# EAGLE design tvbgonesmd4led (EAGLE 6.5.0)
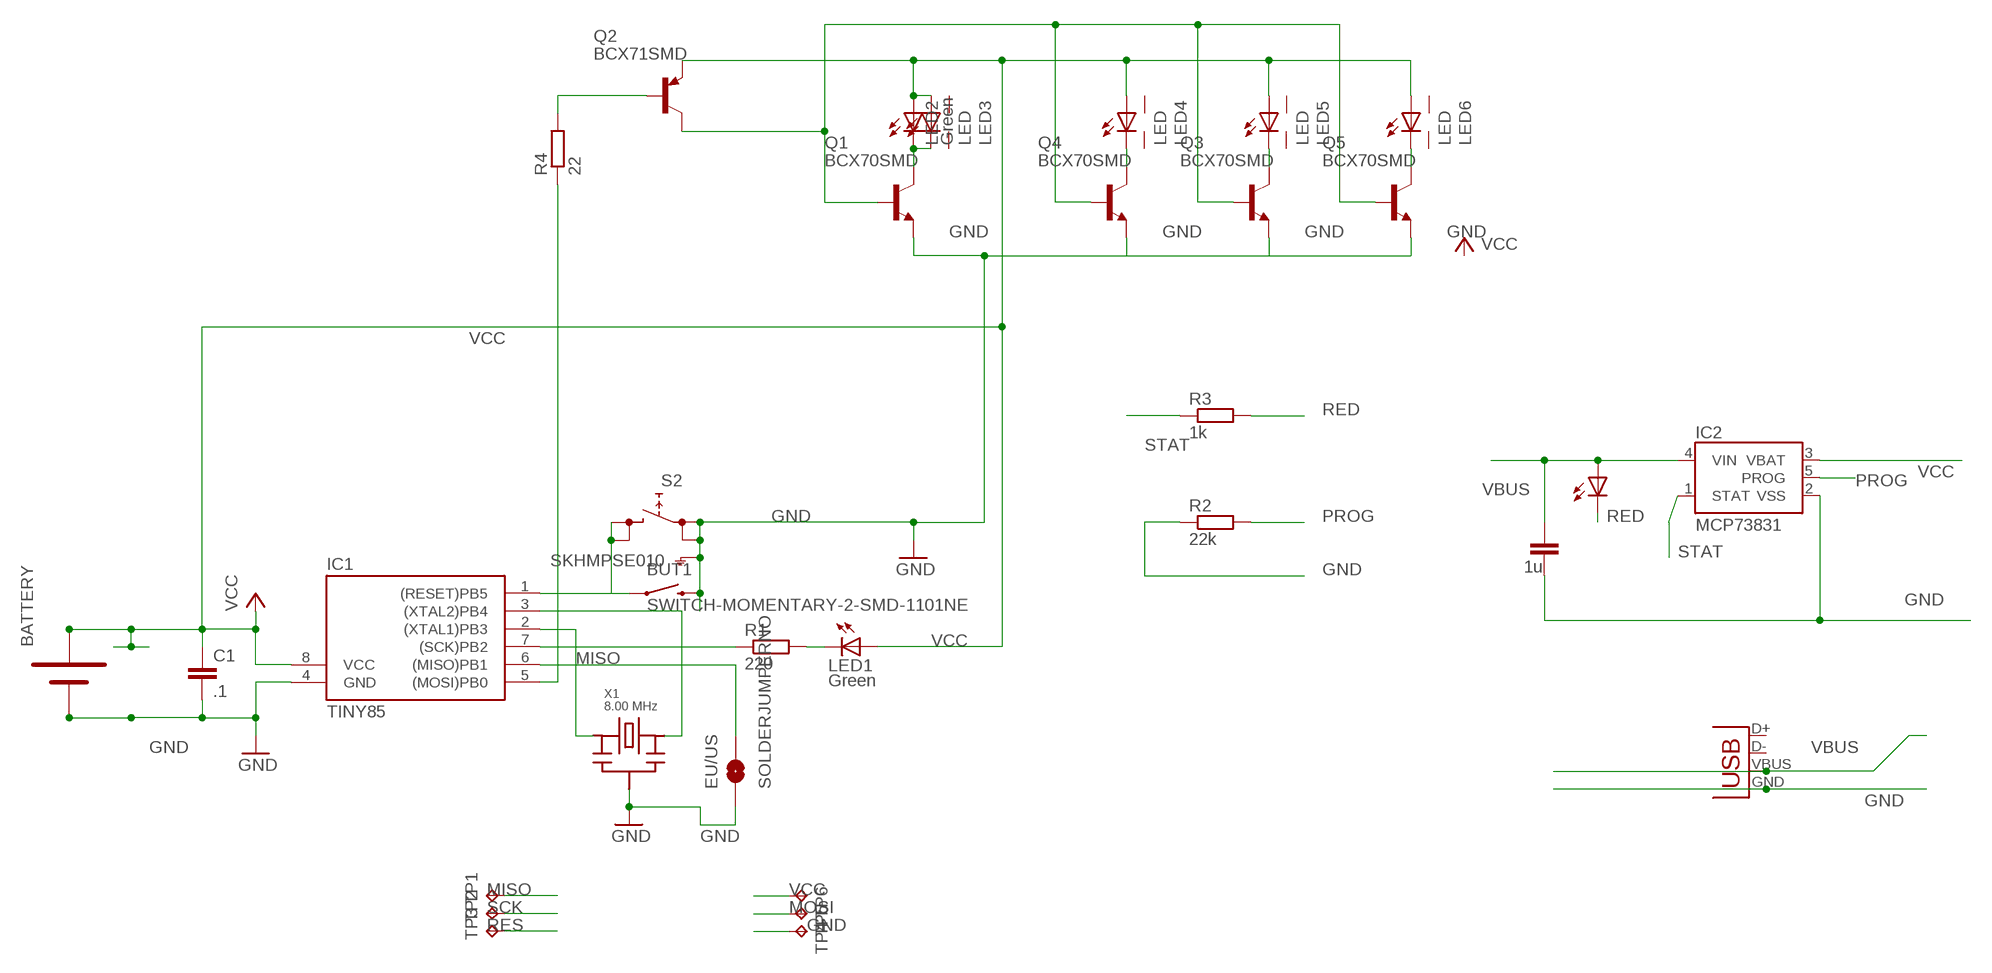
[diagram p0: schematic, sheet 1]

## Parts
BATTERY  BATTERY-1XAA20MM  [BATTCOM_20MM_PTH]
BUT1  SWITCH-MOMENTARY-2-SMD-1101NE  [TACTILE-SWITCH-1101NE]
C1  .1  C-EUC0603  [C0603]
C2  1u  C-EUC0603  [C0603]
CHG  0805  LEDCHIPLED_0603  [CHIPLED_0603]
EU/US  SOLDERJUMPERNO  [SJ_2S-NO]
IC1  TINY85  TINY12S  [SOIC8]
IC2  MCP73831  [SOT23-5]
LED1  Green  LEDCHIPLED_0603  [CHIPLED_0603]
LED2  Green  LEDCHIPLED_0805  [CHIPLED_0805]
LED3  LED  [5MM-SIDE]
LED4  LED  [5MM-SIDE]
LED5  LED  [5MM-SIDE]
LED6  LED  [5MM-SIDE]
Q1  BCX70SMD  [SOT23]
Q2  BCX71SMD  [SOT23]
Q3  BCX70SMD  [SOT23]
Q4  BCX70SMD  [SOT23]
Q5  BCX70SMD  [SOT23]
R1  220  R-EU_R0603  [R0603]
R2  22k  R-EU_R0603  [R0603]
R3  1k  R-EU_R0603  [R0603]
R4  22  R-EU_R0603  [R0603]
S2  SKHMPSE010  [SKHMPXE010]
TP1  TPB1,27  [B1,27]
TP2  TPB1,27  [B1,27]
TP3  TPB1,27  [B1,27]
TP4  TPB1,27  [B1,27]
TP5  TPB1,27  [B1,27]
TP6  TPB1,27  [B1,27]
X1  8.00 MHz  AWSCR-MT  [AWSCR]
X6  USB-MICROB  [USB-MICROB]

## Nets
GND: BATTERY.- BUT1.P$2 C1.2 C2.2 EU/US.1 IC1.4(GND) IC2.2(VSS) Q1.2(E) Q3.2(E) Q4.2(E) Q5.2(E) R2.1 S2.1(1.1) S2.2(1.2) S2.5(SH) TP4.TP X1.P$2(GND) X6.GND
MISO: EU/US.2 IC1.6((MISO)PB1) TP1.TP
MOSI: IC1.5((MOSI)PB0) R4.1 TP5.TP
N$1: LED2.C LED3.K(C) Q1.3(C)
N$2: IC1.2((XTAL1)PB3) X1.P$1
N$3: LED1.C R1.2
N$4: IC1.3((XTAL2)PB4) X1.P$3
N$6: Q2.1(B) R4.2
N$7: Q1.1(B) Q2.3(C) Q3.1(B) Q4.1(B) Q5.1(B)
N$8: LED4.K(C) Q4.3(C)
N$9: LED5.K(C) Q3.3(C)
N$10: LED6.K(C) Q5.3(C)
PROG: IC2.5(PROG) R2.2
RED: CHG.C R3.2
RES: BUT1.P$1 IC1.1((RESET)PB5) S2.3(2.1) S2.4(2.2) TP3.TP
SCK: IC1.7((SCK)PB2) R1.1 TP2.TP
STAT: IC2.1(STAT) R3.1
VBUS: C2.1 CHG.A IC2.4(VIN) X6.VBUS
VCC: BATTERY.+ C1.1 IC1.8(VCC) IC2.3(VBAT) LED1.A LED2.A LED3.A LED4.A LED5.A LED6.A Q2.2(E) TP6.TP
Unconnected: LED3.A2(A1) LED3.K2(C1) LED4.A2(A1) LED4.K2(C1) LED5.A2(A1) LED5.K2(C1) LED6.A2(A1) LED6.K2(C1) X6.D+ X6.D-

## Library data of the parts
BATTERY = es:BATTERY-1XAA
BUT1 = SparkFun:SWITCH-MOMENTARY-2
C1 = rcl:C-EU: CAPACITOR, European symbol
C2 = resistor:C-EU: CAPACITOR, European symbol
CHG LED1 LED2 = led:LED: LED OSRAM: - CHIPLED LG R971, LG N971, LY N971, LG Q971, LY Q971, LO R971, LY R971 LH N974, LH R974 LS Q976, LO Q976, LY Q976 LO Q996 - Hyper CHIPLED LW Q18S LB Q993, LB Q99A, LB R99A - SideLED LS A670, LO A670, LY A670, LG A670, LP A670 LB A673, LV A673, LT A673, LW A673 LH A674 LY A675 LS A676, LA A676, LO A676, LY A676, LW A676 LS A679, LY A679, LG A679 - Hyper Micro SIDELED® LS Y876, LA Y876, LO Y876, LY Y876 LT Y87S - SmartLED LW L88C, LW L88S LB L89C, LB L89S, LG L890 LS L89K, LO L89K, LY L89K LS L896, LA L896, LO L896, LY L896 - TOPLED LS T670, LO T670, LY T670, LG T670, LP T670 LSG T670, LSP T670, LSY T670, LOP T670, LYG T670 LG T671, LOG T671, LSG T671 LB T673, LV T673, LT T673, LW T673 LH T674 LS T676, LA T676, LO T676, LY T676, LB T676, LH T676, LSB T676, LW T676 LB T67C, LV T67C, LT T67C, LS T67K, LO T67K, LY T67K, LW E67C LS E67B, LA E67B, LO E67B, LY E67B, LB E67C, LV E67C, LT E67C LW T67C LS T679, LY T679, LG T679 LS T770, LO T770, LY T770, LG T770, LP T770 LB T773, LV T773, LT T773, LW T773 LH T774 LS E675, LA E675, LY E675, LS T675 LS T776, LA T776, LO T776, LY T776, LB T776 LHGB T686 LT T68C, LB T68C - Hyper Mini TOPLED® LB M676 - Mini TOPLED Santana® LG M470 LS M47K, LO M47K, LY M47K Source: http://www.osram.convergy.de LUXEON: - LUMILED® LXK2-PW12-R00, LXK2-PW12-S00, LXK2-PW14-U00, LXK2-PW14-V00 LXK2-PM12-R00, LXK2-PM12-S00, LXK2-PM14-U00 LXK2-PE12-Q00, LXK2-PE12-R00, LXK2-PE12-S00, LXK2-PE14-T00, LXK2-PE14-U00 LXK2-PB12-K00, LXK2-PB12-L00, LXK2-PB12-M00, LXK2-PB14-N00, LXK2-PB14-P00, LXK2-PB14-Q00 LXK2-PR12-L00, LXK2-PR12-M00, LXK2-PR14-Q00, LXK2-PR14-R00 LXK2-PD12-Q00, LXK2-PD12-R00, LXK2-PD12-S00 LXK2-PH12-R00, LXK2-PH12-S00 LXK2-PL12-P00, LXK2-PL12-Q00, LXK2-PL12-R00 Source: www.luxeon.com KINGBRIGHT: KA-3528ASYC Source: www.kingbright.com
EU/US = SparkFun:SOLDERJUMPER: Solder Jumper Standard SMD solder jumper. Used to automate production. Two varients : Normally Open and Normally Closed are the same, but have different paste layers. NC will have a large amount of paste and should jumper during reflow.
IC1 = atmel:TINY12*: MICROCONTROLLER 1 Kbytes FLASH 64 bytes EEPROM
IC2 = SparkFunNew:MCP73831: Microchip's MCP73831 Miniature single cell, fully integrated Li-Ion, Li-polymer charge management controller http://ww1.microchip.com/downloads/en/DeviceDoc/21984a.pdf
LED3-LED6 = tvbgone:LED
Q1 Q3-Q5 = transistor-npn:BCX70*: NPN Transistor
Q2 = transistor-pnp:BCX71SMD: PNP Transistor
R1-R4 = rcl:R-EU_: RESISTOR, European symbol
S2 = switch:SKHMP*E010: 6.2 X 6.5mm TACT Switch (SMD) Source: http://www3.alps.co.jp/WebObjects/catalog.woa/PDF/E/Switch/Tact/SKHM/SKHM.PDF
TP1-TP6 = testpad:TP: Test pad
X1 = my_resonator:AWSCR-MT
X6 = SparkFun:USB: USB Connectors USB-B-PTH is fully proven SKU : PRT-00139 USB-miniB is fully proven SKU : PRT-00587 USB-A-PCB is untested. USB-A-H is throughly reviewed, but untested. Spark Fun Electronics SKU : PRT-00437 USB-B-SMT is throughly reviewed, but untested. Needs silkscreen touching up. USB-A-S has not been used/tested USB-MB-H has not been used/tested

## Net classes
0 default: width 0.254 mm, drill 0.381 mm, clearance 0.254 mm
1 GND: width 0.254 mm, drill 0.381 mm, clearance 0.254 mm
2 pwr: width 0.254 mm, drill 0.381 mm, clearance 0.254 mm

## Board
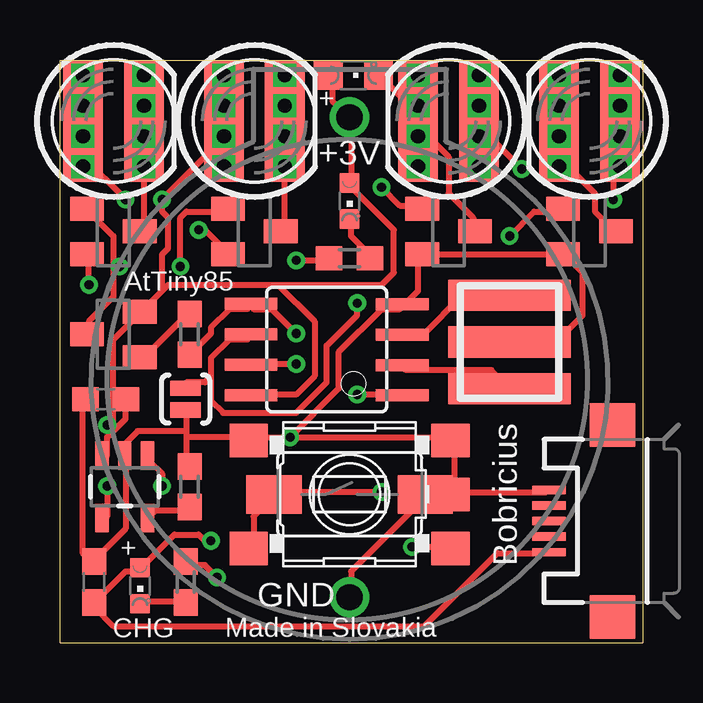
[diagram p1: board, top side]
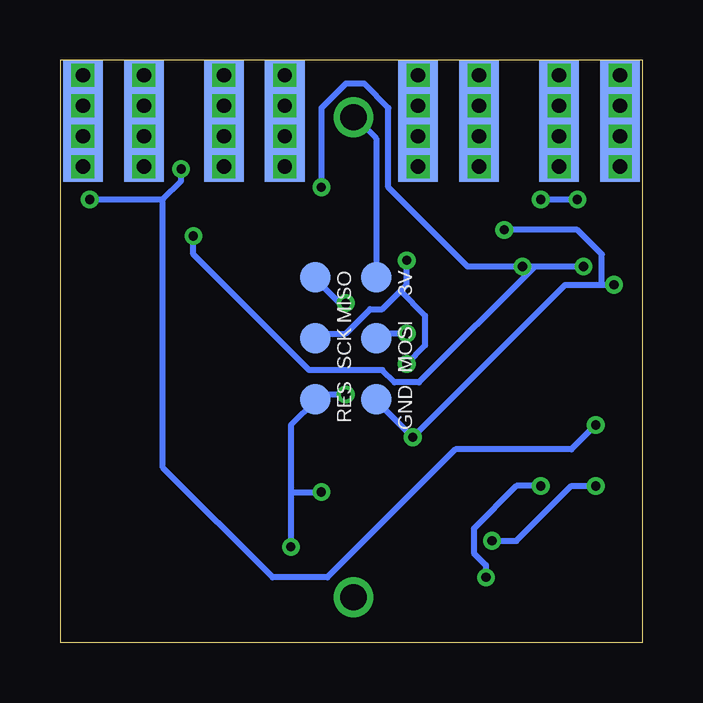
[diagram p2: board, bottom side, seen from below]

Size 24.29 x 24.29 mm. Coordinates in mm from the lower left corner, seen from the top.
Outline: 0,0 0,24.29 24.29,24.29 24.29,0 0,0
Copper layers (1*16): Top 0.0356mm / dielectric 1.5011mm / Bottom 0.0356mm
Design rules "LaenPCBOrder (1) *": minimum track width 6mil, minimum drill 13mil, track to track 8mil, track to pad 8mil, pad to pad 8mil, via to via 8mil, smd to smd 6mil, copper to edge 15mil, drill to drill 6mil, minimum pad ring 7mil, minimum via ring 7mil, stop-mask expansion 4mil, vias tented up to drill 30mil, thermal gap 10mil

### Footprints (pad centres in the part's own frame; a part is rotated, then mirrored left to right if it is on the bottom)
BATTCOM_20MM_PTH = drill 1.1: + 20,0; - 0,0
TACTILE-SWITCH-1101NE = smd 2.3 x 1.6: P$1 -3.15,0; P$2 3.15,0
C0603 = smd 1.1 x 1: 1 -0.85,0; 2 0.85,0
CHIPLED_0603 = smd 0.8 x 0.8: A 0,-0.75; C 0,0.75
SJ_2S-NO = smd 0.635 x 1.27: 1 -0.45,0; 2 0.45,0
SOIC8 = smd 0.5 x 2.2: 1 -1.905,-3.154; 2 -0.645,-3.154; 3 0.625,-3.154; 4 1.895,-3.154; 5 1.905,3.154; 6 0.635,3.154; 7 -0.635,3.154; 8 -1.905,3.154
SOT23-5 = smd 0.55 x 1.2: 1 -0.95,-1.3; 2 0,-1.3; 3 0.95,-1.3; 4 0.95,1.3; 5 -0.95,1.3
CHIPLED_0805 = smd 1.2 x 1.2: A 0,-1.05; C 0,1.05
5MM-SIDE = smd 1.651 x 5.08: A -1.27,0; K 1.27,0 | smd 1.651 x 5.08 bottom: A2 -1.27,0; K2 1.27,0
SOT23 = smd 1 x 1.4: 1 -0.95,-1.1; 2 0.95,-1.1; 3 0,1.1
R0603 = smd 1.1 x 1: 1 -0.85,0; 2 0.85,0
SKHMPXE010 = smd 1.6 x 1.4: 1 -4.2,2.25; 2 4.2,2.25; 3 -4.2,-2.25; 4 4.2,-2.25; 5 4.2,0
B1,27 = smd 1.27 x 1.27: TP 0,0
AWSCR = smd 1.3 x 5.1: P$1 -1.95,0; P$2 0,0; P$3 1.95,0
USB-MICROB = smd 0.35 x 1.4: D+ 0,2.65; D- -0.65,2.65; GND 1.3,2.65; ID 0.65,2.65; VBUS -1.3,2.65 | smd 1.8 x 1.9: MT1 -4,0; MT2 4,0

### Placement (x,y rotation side)
BATTERY  12.06,1.91 90 top
BUT1  12.06,6.19 0 top
C1  1.9,10.16 180 top
C2  1.43,2.54 90 top
CHG  3.33,2.38 180 top
EU/US  5.24,10.16 90 top
IC1  11.11,12.22 90 top
IC2  2.7,6.51 180 top
LED1  12.06,18.41 180 top
LED2  12.22,23.65 270 top
LED3  16.19,21.75 180 top
LED4  2.22,21.75 0 top
LED5  8.1,21.75 0 top
LED6  22.07,21.75 180 top
Q1  16.19,17.14 270 top
Q2  2.22,12.86 90 top
Q3  8.1,17.14 270 top
Q4  2.22,17.14 270 top
Q5  22.07,17.14 270 top
R1  12.06,16.03 0 top
R2  5.4,6.51 270 top
R3  5.24,2.54 270 top
R4  5.4,12.86 90 top
S2  12.06,6.19 0 top
TP1  13.65,15.24 180 bottom
TP2  13.65,12.7 180 bottom
TP3  13.65,10.16 180 bottom
TP4  11.11,10.16 180 bottom
TP5  11.11,12.7 180 bottom
TP6  11.11,15.24 180 bottom
X1  18.73,12.54 90 top
X6  23.02,5.08 90 top

### Tracks (layer width: path | path; a pad name or v marks a point on that pad's centre or on a via)
GND  (via drill 0.38)
  Top 0.254: 16.45,6.29 20.26,6.29 X6.GND | 16.45,6.29 16.45,8.32 S2.2 16.19,8.57 v9.59,8.57 | 16.45,6.29 S2.5 16.19,6.29 15.43,6.29 BUT1.P$2 15.18,6.03 12.13,2.98 12.13,1.97 BATTERY.- | X1.P$2 18.73,12.64 20.76,12.64 21.78,13.65 21.78,15.43 21.02,16.19 Q5.2 20.76,16.19 15.18,16.19 Q1.2 14.92,16.19 14.92,14.67 14.41,14.16 IC1.4 14.16,13.91 13.4,13.91 11.62,12.13 11.62,10.6 v9.59,8.57 | C1.2 0.95,10.1 0.95,3.75 1.21,3.49 C2.2 1.46,3.49 2.73,4.76 2.73,7.56 IC2.2 2.73,7.81 2.73,8.32 3.24,8.83 5.27,8.83 | 5.27,8.83 5.27,9.59 EU/US.1 | 5.27,8.83 5.27,8.57 | 5.27,8.57 5.27,7.56 R2.1 | v9.59,8.57 8.06,8.57 S2.1 7.81,8.57 5.27,8.57 | v1.21,14.92 1.21,16.19 Q4.2 | v5.78,17.21 6.03,17.21 6.79,16.45 Q3.2
  Bottom 0.254: TP4.TP 11.11,10.1 v9.59,8.57 3.24,14.92 1.71,14.92 | 1.71,14.92 v1.21,14.92 | v5.78,17.21 2.73,17.21 1.71,16.19 1.71,14.92
MISO  (via drill 0.38)
  Top 0.254: 6.29,11.11 6.03,10.86 5.27,10.86 EU/US.2 | 6.29,11.11 6.29,11.87 7.05,12.64 7.81,12.64 IC1.6 | v12.38,14.16 12.38,13.65 11.11,12.38 11.11,10.86 9.84,9.59 6.79,9.59 6.29,10.1 6.29,11.11
  Bottom 0.254: v12.38,14.16 12.64,14.16 13.65,15.18 TP1.TP
MOSI  (via drill 0.38)
  Top 0.254: R4.1 5.52,12.13 6.29,12.89 6.29,13.14 7.05,13.91 7.81,13.91 IC1.5 8.06,13.91 8.83,13.91 v9.84,12.89
  Bottom 0.254: v9.84,12.89 11.11,12.89 TP5.TP
N$1
  Top 0.254: LED2.C 13.4,23.56 14.92,22.03 LED3.K 14.92,21.53 16.19,20.26 16.19,18.73 17.21,17.72 17.21,17.21 Q1.3
N$2
  Top 0.254: IC1.2 14.41,11.37 17.97,11.37 18.73,10.6 X1.P$1
N$3
  Top 0.254: LED1.C 12.13,17.46 12.13,16.95 12.89,16.19 R1.2
N$4
  Top 0.254: IC1.3 14.41,12.89 15.18,12.89 16.7,14.41 18.73,14.41 X1.P$3
N$5  (via drill 0.6)
  other vias: 23.34,23.65
N$6
  Top 0.254: R4.2 5.27,13.65 3.49,11.87 Q2.1
N$7  (via drill 0.38)
  Top 0.254: 2.22,15.68 2.22,16.95 1.21,17.97 Q4.1 | 2.22,15.68 2.22,14.41 1.21,13.4 1.21,12.89 Q2.3 | v5.02,15.68 5.02,17.72 5.27,17.97 6.79,17.97 Q3.1 | 2.22,15.68 v2.48,15.68 | v13.4,18.99 14.16,18.22 14.92,18.22 Q1.1 | v18.73,16.95 19.75,17.97 20.76,17.97 Q5.1
  Bottom 0.254: v2.48,15.68 4.51,15.68 | 4.51,15.68 v5.02,15.68 7.3,15.68 10.6,18.99 10.6,22.29 11.62,23.3 12.38,23.3 13.4,22.29 v13.4,18.99 | v18.73,16.95 18.73,16.19 13.91,11.37 10.86,11.37 10.35,10.86 9.33,10.86 4.51,15.68
N$8
  Top 0.254: LED4.K 3.49,17.21 Q4.3
N$9
  Top 0.254: Q3.3 9.33,17.21 9.33,21.53 LED5.K
N$10
  Top 0.254: Q5.3 23.05,17.21 22.29,17.97 22.29,18.73 21.02,20 21.02,21.53 LED6.K
N$11  (via drill 0.6)
  other vias: 23.34,22.38
N$12  (via drill 0.6)
  other vias: 23.34,21.11
N$13  (via drill 0.6)
  other vias: 23.34,19.84
N$14  (via drill 0.6)
  other vias: 0.95,23.65
N$15  (via drill 0.6)
  other vias: 0.95,22.38
N$16  (via drill 0.6)
  other vias: 0.95,21.11
N$17  (via drill 0.6)
  other vias: 0.95,19.84
N$18  (via drill 0.6)
  other vias: 3.49,23.65
N$19  (via drill 0.6)
  other vias: 3.49,22.38
N$20  (via drill 0.6)
  other vias: 3.49,21.11
N$21  (via drill 0.6)
  other vias: 3.49,19.84
N$22  (via drill 0.6)
  other vias: 6.83,23.65
N$23  (via drill 0.6)
  other vias: 6.83,22.38
N$24  (via drill 0.6)
  other vias: 6.83,21.11
N$25  (via drill 0.6)
  other vias: 6.83,19.84
N$26  (via drill 0.6)
  other vias: 9.37,23.65
N$27  (via drill 0.6)
  other vias: 9.37,22.38
N$28  (via drill 0.6)
  other vias: 9.37,21.11
N$29  (via drill 0.6)
  other vias: 9.37,19.84
N$30  (via drill 0.6)
  other vias: 14.92,23.65
N$31  (via drill 0.6)
  other vias: 14.92,22.38
N$32  (via drill 0.6)
  other vias: 14.92,21.11
N$33  (via drill 0.6)
  other vias: 14.92,19.84
N$34  (via drill 0.6)
  other vias: 17.46,23.65
N$35  (via drill 0.6)
  other vias: 17.46,22.38
N$36  (via drill 0.6)
  other vias: 17.46,21.11
N$37  (via drill 0.6)
  other vias: 17.46,19.84
N$38  (via drill 0.6)
  other vias: 20.8,23.65
N$39  (via drill 0.6)
  other vias: 20.8,22.38
N$40  (via drill 0.6)
  other vias: 20.8,21.11
N$41  (via drill 0.6)
  other vias: 20.8,19.84
PROG
  Top 0.254: R2.2 5.27,5.52 4,5.52 3.75,5.27 IC2.5
RED
  Top 0.254: CHG.C 3.49,1.71 5.02,1.71 R3.2
RES  (via drill 0.38)
  Top 0.254: S2.3 8.06,4 8.06,5.27 8.83,6.03 BUT1.P$1 9.08,6.29 v13.4,6.29 | v12.38,10.35 14.16,10.35 IC1.1 | v14.67,4 16.19,4 S2.4
  Bottom 0.254: v12.38,10.35 13.65,10.35 TP3.TP 13.65,10.1 14.67,9.08 14.67,6.29 | 14.67,6.29 v14.67,4 | 14.67,6.29 v13.4,6.29
SCK  (via drill 0.38)
  Top 0.254: v9.84,15.94 11.11,15.94 R1.1 | v9.84,11.62 8.06,11.62 IC1.7
  Bottom 0.254: v9.84,15.94 9.84,14.92 10.1,14.67 | 10.1,14.67 10.86,13.91 11.37,13.91 12.38,12.89 13.65,12.89 TP2.TP | v9.84,11.62 9.08,12.38 9.08,13.65 10.1,14.67
STAT  (via drill 0.38)
  Top 0.254: v6.54,2.73 6.03,3.24 5.27,3.24 R3.1 | v4.25,6.54 4.25,7.05 3.75,7.56 IC2.1
  Bottom 0.254: v6.54,2.73 6.54,3.24 7.05,3.75 7.05,4.76 5.27,6.54 v4.25,6.54
VBUS  (via drill 0.38)
  Top 0.254: v1.97,6.54 1.97,5.27 IC2.4 | v6.29,4.25 6.03,4.25 5.78,4.51 4.76,4.51 3.49,3.24 CHG.A 3.24,2.98 2.73,2.98 1.46,1.71 C2.1 1.46,1.46 2.22,0.7 15.18,0.7 18.22,3.75 20.26,3.75 X6.VBUS
  Bottom 0.254: v1.97,6.54 2.98,6.54 5.27,4.25 v6.29,4.25
VCC  (via drill 0.38)
  Top 0.254: v19.24,19.75 17.46,21.53 LED3.A | v23.05,18.48 23.05,21.27 23.3,21.53 LED6.A | LED4.A 0.95,20.26 v2.73,18.48 | LED5.A 6.79,21.53 6.79,21.02 v4.25,18.48 4.25,17.97 4.51,17.72 4.51,16.45 4.25,16.19 4.25,14.67 | LED2.A 11.37,23.56 11.37,22.54 11.87,22.03 BATTERY.+ 12.13,21.78 12.13,19.24 LED1.A 12.13,18.99 13.91,17.21 13.91,15.43 13.4,14.92 9.08,14.92 | 2.22,8.83 1.97,8.57 1.97,7.81 IC2.3 | 2.22,8.83 2.73,9.33 2.73,10.1 C1.1 | 2.22,8.83 2.22,9.08 | 2.22,9.08 2.22,12.64 3.24,13.65 Q2.2 3.49,13.91 4.25,14.67 | 9.08,14.92 10.6,13.4 10.6,11.11 9.84,10.35 8.06,10.35 IC1.8 | 9.08,14.92 4.51,14.92 4.25,14.67 | 2.22,9.08 v1.97,9.08
  Bottom 0.254: v19.24,19.75 19.24,19.24 20,18.48 | v23.05,18.48 20,18.48 | v4.25,18.48 v2.73,18.48 | TP6.TP 11.11,21.02 11.87,21.78 BATTERY.+ | 20,18.48 20,7.3 15.43,2.73 13.14,2.73 7.81,8.06 2.98,8.06 v1.97,9.08

### Text on the board
tNames: + | +3V | AtTiny85 | Bobricius | + | GND | CHG | Made in Slovakia
bNames: 3V | MISO | MOSI | SCK | RES | GND